# Altium project Soldeerstation.PrjPcb
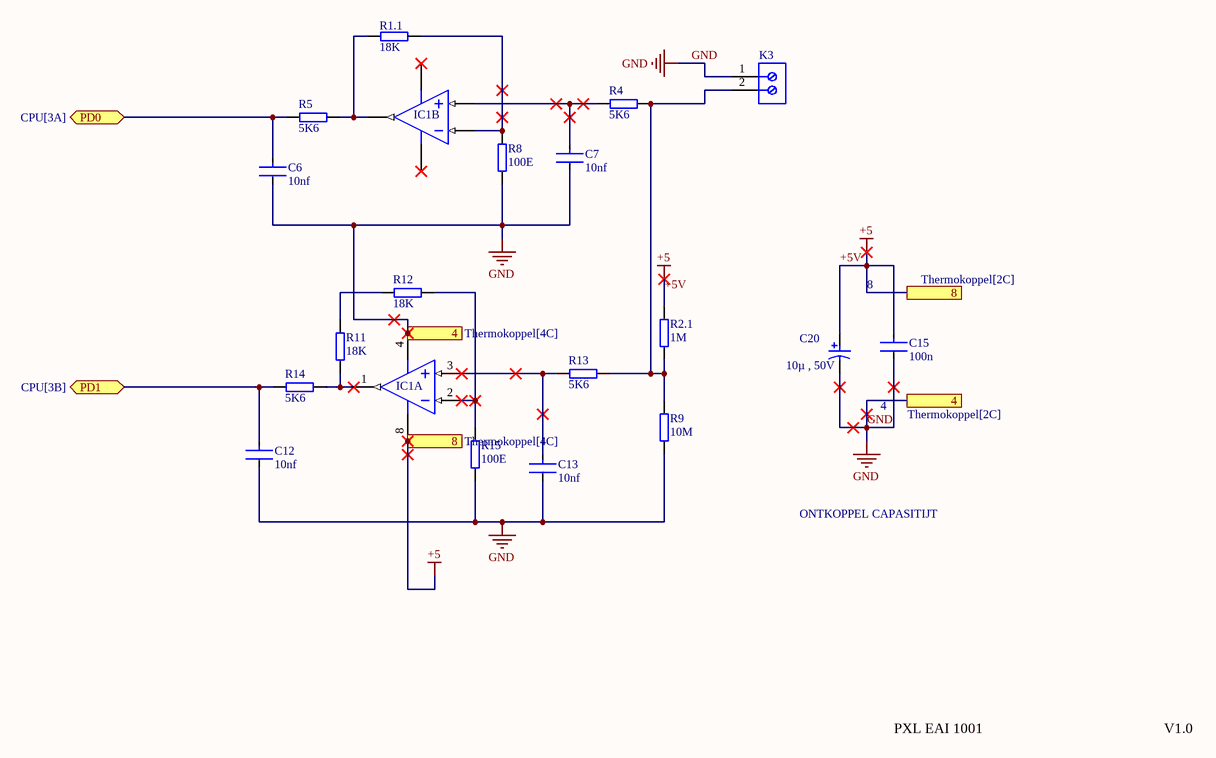
[diagram p0: Thermokoppel.SchDoc]
blad: Soldeerstation; Naam: Ceyhan Yildiz; Sheet: =SheetNumber +' van ' +SheetTotal
5 sheets, 75 parts. Net scope: flat (ports and power ports of the same name join across sheets).
Board files: Soldeer.PcbDoc, Displayd.PcbDoc
Sheets:
  Thermokoppel.SchDoc
  Voeding.SchDoc
  CPU.SchDoc
  PBM_soldeerbout.SchDoc
  Display.SchDoc

## Sheet Thermokoppel.SchDoc
size A4; SheetNumber: 1; SheetTotal: 5

### Parts
C6  10nf  [CC_0805_L]
C7  10nf  [CC_0805_L]
C12  10nf  [CC_0805_L]
C13  10nf  [CC_0805_L]
C15  100n  [CC_0805_L]
C20  10µ , 50V  [CE_D8_L10]
IC1  Dual_Opamp  [MSOP_8_M]  (value not drawn)  (parts A,B of 2)
K3  282836-2  [terminal_block]  (value not drawn)
R1.1  18K  [R_0805_M]
R2.1  1M  [R_0805_M]
R4  5K6  [R_0805_M]
R5  5K6  [R_0805_M]
R8  100E  [R_0805_M]
R9  10M  [R_0805_M]
R11  18K  [R_0805_M]
R12  18K  [R_0805_M]
R13  5K6  [R_0805_M]
R14  5K6  [R_0805_M]
R15  100E  [R_0805_M]

### Ports
4 (see Thermokoppel[2C]), 4 (see Thermokoppel[4C]), 8 (see Thermokoppel[2C]), 8 (see Thermokoppel[4C]), PD0 (bidir, see CPU[3A]), PD1 (bidir, see CPU[3B])

### Nets
+5: C15.1 C20.2 IC1.8(VDD) R2.1.2 ; port 8  [also labelled +5V]
GND: C6.2 C7.2 C12.2 C13.2 C15.2 C20.1 IC1.4(VSS) K3.1 R8.1 R9.1 R15.1 ; port 4
NetC6_1: C6.1 R5.1 ; port PD0
NetC7_1: C7.1 IC1.5(VINB+) R4.1
NetC12_1: C12.1 R14.1 ; port PD1
NetC13_1: C13.1 IC1.3(VINA+) R13.1
NetIC1_1: IC1.1(VOUTA) R11.1 R14.2
NetIC1_2: IC1.2(VINA-) R12.2 R15.2
NetIC1_6: IC1.6(VINB-) R1.1.2 R8.2
NetIC1_7: IC1.7(VOUTB) R1.1.1 R5.2
NetK3_2: K3.2 R2.1.1 R4.2 R9.2 R13.2
NetR11_2: R11.2 R12.1

### Notes on the sheet
- 8
- 4
- ONTKOPPEL CAPASITIJT
- PXL EAI 1001
- V1.0

### Library data of the parts
C6 C7 C12 C13 C15 = Capacitor_Ceramic: Manufacturer: KEMET; Manufacturer Part Number: C0805C224K5RACTU; Value: 0.22 μF; Temperature Characteristic: X7R; Temperature Coefficient: 30ppm/°C; Tolerance: 0.1; Voltage Rating: 50 V; ComponentLink2URL: https://content.kemet.com/datasheets/KEM_C1003_C0G_SMD.pdf; Device Class L3: Ceramic Capacitors; Lead Free: Yes; Temperature: -55°C to +125°C; RoHS: TRUE; Capacitance: 0.22 μF; Automotive: No; Material: Ceramic; Octopart: https://octopart.com/c0805c224k5ractu-kemet-144670; Temperature Range Low: -55°C; Height: 0.88mm; Device Class L1: Passive Components; Digikey Description: CAP CER 0.22UF 50V X7R 0805; ComponentLink2Description: Datasheet; Mouser Description: CAP CER 0.22UF 50V X7R 0805; Category: Cap; Ipc Land Pattern Name: CAPC200125X78; Temperature Range High: +125°C; Package: C0805C-DN; Device Class L2: Capacitors
C20 = Capacitor_Electrolytic: Manufacturer: Panasonic; Voltage Rating: 25 V; ComponentLink2URL: http://industrial.panasonic.com/cdbs/www-data/pdf/RDE0000/ABA0000C1181.pdf; Height: 10.2 mm; Max Operating Temperature: 105 degC; PackageReference: EEE-FK1E221P; ComponentLink1Description: Manufacturer URL; ComponentLink1URL: http://www.panasonic.com/; Mount: Surface Mount; REACH SVHC: No SVHC; Min Operating Temperature: -55 degC; ComponentLink2Description: Datasheet; DatasheetVersion: 03/2016; Length: 10.2 mm; RoHSCompliant: true; Packaging: Tape and Reel; Package Quantity: 500; Lead Pitch: 3.1 mm; Pins: 2; PackageDescription: 2-Pin Electrolytic Aluminum Capacitor, Body 8.3 x 8.3 mm; Mounting Technology: Surface Mount
IC1 = Dual_Opamp: Slew Rate: 0.6V/µs; Supply Current: 100uA; Power Supply Rejection Ratio (PSRR): 86dB; Input Offset Voltage (Vos): 4.5mV; Input Bias Current: 1pA; Amplifier Type: GENERAL PURPOSE; Unity Gain Bandwidth Product: 1MHz; Number of Circuits: 2; Output Current: 23mA; Operating Supply Voltage: 5.5V; Min Supply Voltage: 1.8V; Common Mode Rejection Ratio: 60dB; Voltage Gain: 112dB; Max Supply Voltage: 6V; Package Quantity: 60; REACH SVHC: No SVHC; Min Operating Temperature: -40°C; Max Operating Temperature: 125°C; Mount: Through Hole; Nominal Supply Current: 100uA; Height: 3.3mm; Length: 9.27mm; Slew Rate-Nom: 0.6V/µs; Packaging: Rail/Tube; Output Current per Channel: 23mA; Number of Amplifiers: 2; RoHS Compliant: Yes; Radiation Hardening: No; Bandwidth: 1MHz; Lead Free: Lead Free; Width: 6.35mm; Number of Channels: 2; Gain Bandwidth Product: 1MHz; Technology: CMOS; Operating Supply Current: 100uA; Number of Elements: 2; Number of Pins: 8; Input Offset Voltage-Max: 4.5mV; Case/Package: PDIP
K3 = 1x2 terminal block: Female Header, Pitch 5 mm, 1 x 2 Position, Height 10 mm, Tail Length 3.5 mm, Rohs, Bulk; Manufacturer: TE Connectivity; Wire Gauge: 16-30AWG; Product Training Modules: Wire-to-BoardEurostyleTerminalBlocks; Clamp Material - Plating: Brass-NickelPlated; Voltage: 300V; Mating Orientation: HorizontalwithBoard; Current: 13.5A; Pitch: 0.197"(5.00mm); Screw Thread: M3; 3D Model: 282836-2.pdf; Other Names: 5ULV-02B / A98076; Dynamic Catalog: BuchananSeries; Number of Levels: 1; Torque - Screw: 0.68Nm(6Lb-In); Featured Product: EurostyleTerminalBlockConnectors; Positions Per Level: 2; Wire Termination: Screw-RisingCageClamp; Datasheet URL: http://www.te.com.cn/commerce/DocumentDelivery/DDEController?Action=showdoc&DocId=Catalog+Section%7F1308389_EUROSTYLE_TERMINAL_BLOCKS%7F0607%7Fpdf%7FEnglish%7FENG_CS_1308389_EUROSTYLE_TERMINAL_BLOCKS_0607.pdf%7F282836-2; Color: Green; Family: TerminalBlocks-WiretoBoard; RoHS Information: 282836-2StatementofCompliance; Standard Package: 300; Contact Material - Plating: Brass-TinPlated; Manufacturer URL: http://www.te.com; Housing Material: Polyamide(PA66),Nylon6/6; Features: Interlocking(Side); Package Description: Female Header, Pitch 5 mm, 1 x 2 Position, Height 10 mm, Tail Length 3.5 mm; Mounting Type: ThroughHole; Package Reference: THD; Packaging: Bulk; Series: Buchanan; Category: Connectors,Interconnects; Screw Material - Plating: Brass-NickelPlated
R1.1 R2.1 R4 R5 R8 R9 R11-R15 = Resistor: Manufacturer: Vishay Dale; Part Number: CRCW08050000Z0EA

## Sheet Voeding.SchDoc
size A4; Address1: PXL EAI 1001; Revision: V 1.0; SheetNumber: 2; SheetTotal: 5
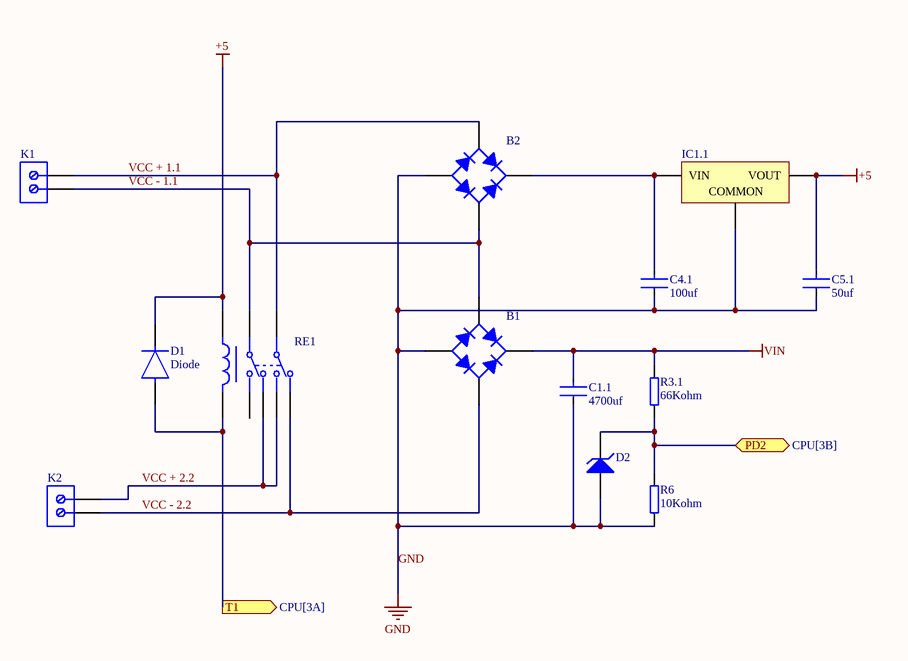
[diagram p1: Voeding.SchDoc]

### Parts
B1  Bridge_Rectifier  [ttf]  (value not drawn)
B2  Bridge_Rectifier  [ttf]  (value not drawn)
C1.1  4700uf  [CE_D25_L25_plugin]
C4.1  100uf  [CC_0805_L]
C5.1  50uf  [CC_0805_L]
D1  Diode  [SOD-123FL]
D2  Zener_Diode  [SOD-123FL]  (value not drawn)
IC1.1  OKI-78SR-5/1.5-W36-C  [OKI78SR515W36C]  (value not drawn)
K1  282836-2  [terminal_block]  (value not drawn)
K2  282836-2  [terminal_block]  (value not drawn)
R3.1  66Kohm  [CC_0805_m]
R6  10Kohm  [CC_0805_m]
RE1  RELAY_GENERAL_PURPOSE  [RT42]  (value not drawn)

### Ports
PD2 (bidir, see CPU[3B]), T1 (out, see CPU[3A])

### Nets
+5: C5.1.1 D1.1(C) IC1.1.3(VOUT) RE1.A1
GND: B1.2(A) B2.2(A) C1.1.2 C4.1.2 C5.1.2 D2.2(A) IC1.1.2(COMMON) R6.2
VIN: B1.1(K) C1.1.1 R3.1.1
VCC + 1.1: B2.3(C) K1.2 RE1.21
VCC + 2.2: K2.2 RE1.12 RE1.24
VCC - 1.1: B1.3(C) B2.4(C) K1.1 RE1.11
VCC - 2.2: B1.4(C) K2.1 RE1.22
NetB2_1: B2.1(K) C4.1.1 IC1.1.1(VIN)
NetD1_2: D1.2(A) RE1.A2 ; port T1
NetD2_1: D2.1(K) R3.1.2 R6.1 ; port PD2

Not connected (* = marked no-connect by the designer): RE1 14

### Library data of the parts
B1 B2 = Bridge_Rectifier: Manufacturer: Diodes Inc; Average Rectified Current-Max: 0.8A; Reverse Voltage-Max [Vrrm]: 600V; Forward Voltage: 1V; Peak Current-Max: 30A; Reverse Current-Max: 5µA; Package Version: 05/2016; Package URL: http://www.diodes.com/_files/packages/MiniDIP.pdf; Datasheet Version: Rev. 13-2, 12/2010; Datasheet URL: http://www.diodes.com/_files/datasheets/ds17003.pdf; Mounting Technology: SurfaceMount; Manufacturer URL: http://www.diodes.com/; Package Reference: MiniDIP-4; Package Description: 4-Pin Small Outline Integrated Circuit, Body 4.7 x 3.8 mm, Pitch 2.5 mm
C1.1 C4.1 C5.1 = Capacitor_Ceramic: as C6 on sheet Thermokoppel; ComponentLink2URL: https://content.kemet.com/datasheets/KEM_C1003_C0G_SMD.pdf; Device Class L3: Ceramic Capacitors; Lead Free: Yes; Temperature: -55°C to +125°C; RoHS: TRUE; Capacitance: 0.22 μF; Automotive: No; Material: Ceramic; Octopart: https://octopart.com/c0805c224k5ractu-kemet-144670; Temperature Range Low: -55°C; Height: 0.88mm; Device Class L1: Passive Components; Digikey Description: CAP CER 0.22UF 50V X7R 0805; ComponentLink2Description: Datasheet; Mouser Description: CAP CER 0.22UF 50V X7R 0805; Category: Cap; Ipc Land Pattern Name: CAPC200125X78; Temperature Range High: +125°C; Package: C0805C-DN; Device Class L2: Capacitors
D1 = Diode: Manufacturer Part Number: 1N4007; Manufacturer: Diotec; Max Surge Forward Current: 27A; Forward Current: 1A; Max Junction Temp: +175°C; Reverse Voltage: 1000V; Value: 15pF; Peak Reverse Current: 5uA; Category: Diode; Temperature Range Low: -50°C; Automotive: No; Temperature: -50°C to +175°C; Lead Free: Yes; ComponentLink2Description: Datasheet; Max Repetitive Reverse Voltage: 1000V; ComponentLink2URL: https://datasheet.octopart.com/1N4007-Diotec-datasheet-62346875.pdf; Device Class L3: Rectifier Diodes; Height: 2.8mm; Octopart: https://octopart.com/1n4007-diotec-4040411; Package: 1N4007; Temperature Range High: +175°C; Device Class L1: Discrete Semiconductors; Device Class L2: Diodes; RoHS: TRUE; Capacitance: 15pF; Ipc Land Pattern Name: DIOAD888W100L520D280
D2 = Zener_Diode: Manufacturer: On Semiconductor; PartNumber: 1SMB5920BT3G; Packing: Tape and Reel; VZ Typ (V): 6.2; PackageDescription: 2-Pin Small Molded Package, J-Bend Lead, Body 4.33 x 3.625 mm; Mounting Technology: Surface Mount; PackageVersion: Rev. H, 05/2011; ComponentLink1Description: Manufacturer URL; RoHS: Pb-Free; DatasheetVersion: Rev. 8; ComponentLink2Description: Datasheet; ComponentLink2URL: http://www.onsemi.com/pub_link/Collateral/1SMB5913BT3-D.PDF; ComponentLink1URL: http://www.onsemi.com/; ComponentLink3Description: Package Specification; PackageReference: SMB-2-403A-03_H; ComponentLink3URL: http://www.onsemi.com/pub_link/Collateral/1SMB5913BT3-D.PDF
IC1.1 = OKI-78SR-5/1.5-W36-C: Non-Isolated DC/DC Converter, 7.5 W, 7 to 36 V, 1.5 A, -40 to 85 degC, 3-Pin THD, RoHS; Manufacturer: Murata; Current - Output (Max): 1.5A; Power (Watts) - Max: 8W; Efficiency: 90.5%; Voltage - Input (Min): 7V; Voltage - Input (Max): 36V; Voltage - Output 1: 5V; Number of Outputs: 1; Package / Case: 3-SIPModule; Features: SCP; Type: LinearRegulatorReplacement; Size / Dimension: 0.41"Lx0.30"Wx0.65"H(10.4mmx7.6mmx16.5mm); Datasheet URL: https://datasheet.ciiva.com/8006/1790439-8006672.pdf; Datasheet Version: Oct-13; Power (Watts) - Manufacture Series: 8W; Voltage - Output 2: -; Series: Okami™OKI-78SR; Family: DCDCConverters; Manufacturer URL: http://www.murata.com/; Category: PowerSupplies-BoardMount; Voltage - Isolation: -; Packaging: Tube; Applications: ITE(Commercial); Mounting Type: ThroughHole; Voltage - Output 3: -; Operating Temperature: -40degC~85degC
K1 K2 = 1x2 terminal block: as K3 on sheet Thermokoppel; Datasheet URL: http://www.te.com.cn/commerce/DocumentDelivery/DDEController?Action=showdoc&DocId=Catalog+Section%7F1308389_EUROSTYLE_TERMINAL_BLOCKS%7F0607%7Fpdf%7FEnglish%7FENG_CS_1308389_EUROSTYLE_TERMINAL_BLOCKS_0607.pdf%7F282836-2; Color: Green; Family: TerminalBlocks-WiretoBoard; RoHS Information: 282836-2StatementofCompliance; Standard Package: 300; Contact Material - Plating: Brass-TinPlated; Manufacturer URL: http://www.te.com; Housing Material: Polyamide(PA66),Nylon6/6; Features: Interlocking(Side); Package Description: Female Header, Pitch 5 mm, 1 x 2 Position, Height 10 mm, Tail Length 3.5 mm; Mounting Type: ThroughHole; Package Reference: THD; Packaging: Bulk; Series: Buchanan; Category: Connectors,Interconnects; Screw Material - Plating: Brass-NickelPlated
R3.1 R6 = Resistor: as R1.1 on sheet Thermokoppel
RE1 = RELAY_GENERAL_PURPOSE: Manufacturer Part Number: RT424005; Manufacturer: TE Connectivity; Coil Power: 403mW; Throw Configuration: DPDT; Coil Voltage: 5V; Number Of Contacts: 2; Coil Resistance: 62Ω; Current Rating: 8A; Coil Type: Non-Latching; Category: Relay; Octopart: https://octopart.com/5-1393243-9-te+connectivity-41835766; Device Class L3: Power Relays; ComponentLink2URL: https://www.te.com/commerce/DocumentDelivery/DDEController?Action=showdoc&DocId=Data+Sheet%7FRT2%7F1014%7Fpdf%7FEnglish%7FENG_DS_RT2_1014.pdf%7F5-1393243-9; Ambient Temperature Range High: +85°C; ComponentLink2Description: Datasheet; Digikey Description: RELAY GENERAL PURPOSE DPDT 8A 5V; Package: RT424005; Automotive: No; Device Class L1: Electromechanical; Height: 15.7mm; Device Class L2: Relays; Ambient Temperature Range Low: -40°C; Mouser Description: General Purpose Relay, Rt2 Series, Power, Non Latching, Dpdt, 5 Vdc, 8 A Rohs Compliant: Yes; Lead Free: Yes; RoHS: TRUE

## Sheet CPU.SchDoc
size A4; Address1: PXL EAI 1001; Revision: V 1.0; SheetNumber: 3; SheetTotal: 5; Sheet: 3 van 5
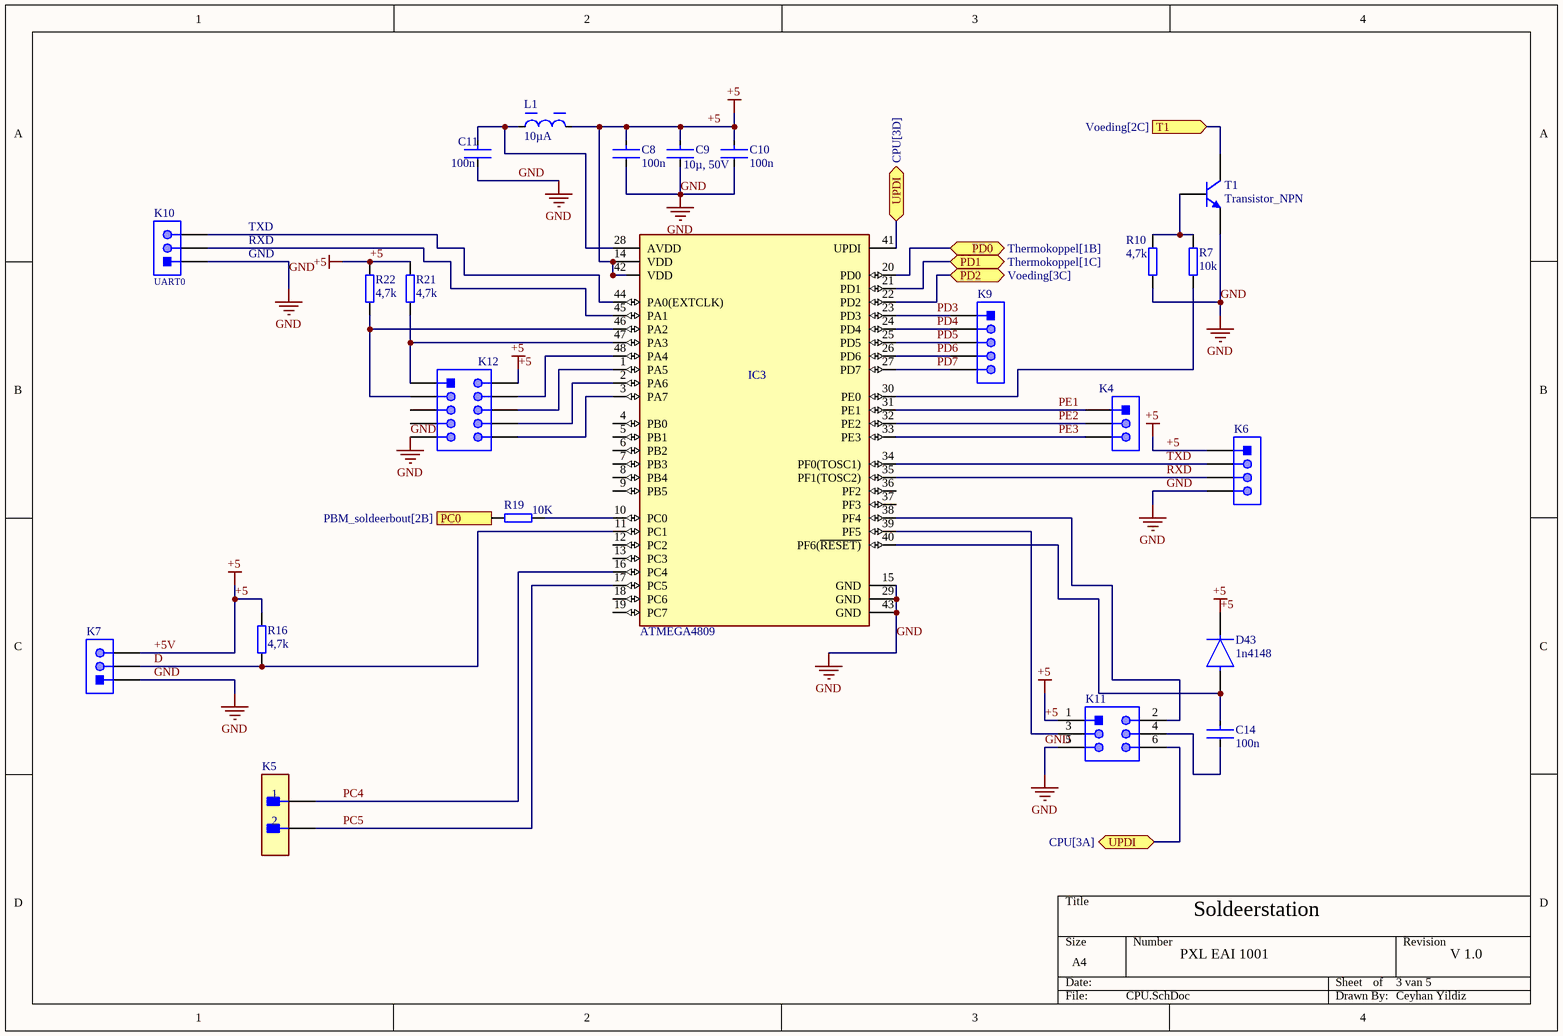
[diagram p2: CPU.SchDoc]

### Parts
C8  100n  [CC_0805_L]
C9  10µ, 50V  [CC_0805_L]
C10  100n  [CC_0805_L]
C11  100n  [CC_0805_L]
C14  100n  [CC_0805_L]
D43  1n4148  [SOD-123FL]
IC3  ATMEGA4809  [TQFP_48_M]
K4  61300311121  [pin header 1x3 - duplicate]  (value not drawn)
K5  M20-9990246  [pin header 1x2 - duplicate]  (value not drawn)
K6  61300411121  [pin header 1x4 - duplicate]  (value not drawn)
K7  61300311121  [pin header 1x3 - duplicate]  (value not drawn)
K9  61300511121  [pin header 1x5]  (value not drawn)
K10  UART0  [pin header 1x3 - duplicate]
K11  61300621121  [pin header 2x6]  (value not drawn)
K12  61201021621  [box header 10-pin]  (value not drawn)
L1  10µA  [CC_0805_L]
R7  10k  [R_0805_M]
R10  4,7k  [R_0805_M]
R16  4,7k  [R_0805_M]
R19  10K  [R_0805_M]
R21  4,7k  [R_0805_M]
R22  4,7k  [R_0805_M]
T1  Transistor_NPN  [SOT_23]

### Ports
PC0 (see PBM_soldeerbout[2B]), PD0 (bidir, see Thermokoppel[1B]), PD1 (bidir, see Thermokoppel[1C]), PD2 (bidir, see Voeding[3C]), T1 (in, see Voeding[2C]), UPDI (bidir, see CPU[3A]), UPDI (bidir, see CPU[3D])

### Nets
+5: C8.1 C9.1 C10.1 D43.1(C) IC3.14(VDD) IC3.42(VDD) K6.1 K7.3 K11.1 K12.2 L1.2 R16.2 R21.2 R22.2  [also labelled +5V]
GND: C8.2 C9.2 C10.2 C11.2 IC3.15(GND) IC3.29(GND) IC3.43(GND) K6.4 K7.1 K10.1 K11.5 K12.9 R10.1 T1.3(E)
D: IC3.11(PC1) K7.2 R16.1
PC4: IC3.16(PC4) K5.1
PC5: IC3.17(PC5) K5.2
PD3: IC3.23(PD3) K9.1
PD4: IC3.24(PD4) K9.2
PD5: IC3.25(PD5) K9.3
PD6: IC3.26(PD6) K9.4
PD7: IC3.27(PD7) K9.5
PE1: IC3.31(PE1) K4.1
PE2: IC3.32(PE2) K4.2
PE3: IC3.33(PE3) K4.3
RXD: IC3.35(PF1(TOSC2)) K6.3
TXD: IC3.34(PF0(TOSC1)) K6.2
NetC6_1: IC3.20(PD0) ; port PD0
NetC11_1: C11.1 IC3.28(AVDD) L1.1
NetC12_1: IC3.21(PD1) ; port PD1
NetC14_1: C14.1 D43.2(A) IC3.40(PF6(~{RESET)})
NetC14_2: C14.2 K11.4
NetD1_2: T1.1(C) ; port T1
NetD2_1: IC3.22(PD2) ; port PD2
NetIC3_1: IC3.1(PA5) K12.6
NetIC3_2: IC3.2(PA6) K12.8
NetIC3_3: IC3.3(PA7) K12.10
NetIC3_10: IC3.10(PC0) R19.2
NetIC3_30: IC3.30(PE0) R7.1
NetIC3_38: IC3.38(PF4) K11.2
NetIC3_39: IC3.39(PF5) K11.3
NetIC3_41: IC3.41(UPDI) K11.6 ; port UPDI
NetIC3_44: IC3.44(PA0(EXTCLK)) K10.3
NetIC3_45: IC3.45(PA1) K10.2
NetIC3_46: IC3.46(PA2) K12.3 R22.1
NetIC3_47: IC3.47(PA3) K12.1 R21.1
NetIC3_48: IC3.48(PA4) K12.4
NetR7_2: R7.2 R10.2 T1.2(B)
NetR19_1: R19.1 ; port PC0

Not connected (* = marked no-connect by the designer): IC3 4(PB0) 5(PB1) 6(PB2) 7(PB3) 8(PB4) 9(PB5) 12(PC2) 13(PC3) 18(PC6) 19(PC7) 36(PF2) 37(PF3); K12 5 7

### Notes on the sheet
- TXD
- RXD
- GND

### Library data of the parts
C8 C10 C11 C14 = Capacitor_Ceramic: as C6 on sheet Thermokoppel; ComponentLink2URL: https://content.kemet.com/datasheets/KEM_C1003_C0G_SMD.pdf; Device Class L3: Ceramic Capacitors; Lead Free: Yes; Temperature: -55°C to +125°C; RoHS: TRUE; Capacitance: 0.22 μF; Automotive: No; Material: Ceramic; Octopart: https://octopart.com/c0805c224k5ractu-kemet-144670; Temperature Range Low: -55°C; Height: 0.88mm; Device Class L1: Passive Components; Digikey Description: CAP CER 0.22UF 50V X7R 0805; ComponentLink2Description: Datasheet; Mouser Description: CAP CER 0.22UF 50V X7R 0805; Category: Cap; Ipc Land Pattern Name: CAPC200125X78; Temperature Range High: +125°C; Package: C0805C-DN; Device Class L2: Capacitors
C9 = Capacitor_Ceramic: Manufacturer: KEMET; Manufacturer Part Number: C0805C224K5RACTU; Value: 0.22 μF; Temperature Characteristic: X7R; Temperature Coefficient: 30ppm/°C; Tolerance: 0.1; ComponentLink2URL: https://content.kemet.com/datasheets/KEM_C1003_C0G_SMD.pdf; Device Class L3: Ceramic Capacitors; Lead Free: Yes; Temperature: -55°C to +125°C; RoHS: TRUE; Capacitance: 0.22 μF; Automotive: No; Material: Ceramic; Octopart: https://octopart.com/c0805c224k5ractu-kemet-144670; Temperature Range Low: -55°C; Height: 0.88mm; Device Class L1: Passive Components; Digikey Description: CAP CER 0.22UF 50V X7R 0805; ComponentLink2Description: Datasheet; Mouser Description: CAP CER 0.22UF 50V X7R 0805; Category: Cap; Ipc Land Pattern Name: CAPC200125X78; Temperature Range High: +125°C; Package: C0805C-DN; Device Class L2: Capacitors; Voltage Rating: 50 V
D43 = Diode: as D1 on sheet Voeding; Category: Diode; Temperature Range Low: -50°C; Automotive: No; Temperature: -50°C to +175°C; Lead Free: Yes; ComponentLink2Description: Datasheet; Max Repetitive Reverse Voltage: 1000V; ComponentLink2URL: https://datasheet.octopart.com/1N4007-Diotec-datasheet-62346875.pdf; Device Class L3: Rectifier Diodes; Height: 2.8mm; Octopart: https://octopart.com/1n4007-diotec-4040411; Package: 1N4007; Temperature Range High: +175°C; Device Class L1: Discrete Semiconductors; Device Class L2: Diodes; RoHS: TRUE; Capacitance: 15pF; Ipc Land Pattern Name: DIOAD888W100L520D280
IC3 = ATMEGA4809: Peripherals: Brown-out Detect/Reset; Number of I/Os: 41; Core Architecture: AVR; Memory Size: 48KB; Interface: I2C; Oscillator Type: Internal; Memory Type: FLASH; Series: megaAVR® 0, Functional Safety (FuSa); Min Operating Temperature: -40°C; Mount: Surface Mount; Case/Package: TQFP; RoHS Compliant: Yes; Max Operating Temperature: 85°C
K4 K7 = 1x3: THT Vertical Pin Header WR-PHD, Pitch 2.54 mm, Single Row, 3 pins; Manufacturer: Wurth Elektronik; Withstanding Voltage: 500VAC; Working Voltage: 250VAC; Rated Current: 3A; Pitch: 2.54mm; Pin Number: 3; Gender: Male; Contact Resistance: 20mOhm; Package Reference: 61300311121; Manufacturer URL: http://www.we-online.de; Datasheet URL: https://katalog.we-online.de/em/datasheet/6130xx11121.pdf; Operating Temperature: -40to105degC; Part Number: 61300311121; Orientation: Vertical; Packaging: Bag; Row Number: Single; Mounting Technology: THT; Publisher: WurthElektronik
K5 = 1x2: CONN HEADER VERT 2POS 2.54MM; Manufacturer: Harwin; Conn Gender: Male; Conn Orientation: Vertical; Number Of Contacts: 2; Current Rating: 3A; ComponentLink2URL: https://cdn.harwin.com/pdfs/M20-999.pdf; ComponentLink2Description: Datasheet; Package: M20-9990246; Temperature: -40°C to +105°C; Octopart: https://octopart.com/m20-9990246-harwin-2590635; Mouser Description: 2.54mm (0.1") Pitch SIL Vertical PC Tail Pin Header, 6.1mm mating pin height, tin, 2 contacts; Temperature Range High: +105°C; Device Class L1: Connectors; RoHS: TRUE; Automotive: No; Height: 8.99mm; Number Of Rows: 1; Contact Material: Tin,Nickel; Category: Conn; Pitch: 2.54mm; Lead Free: Yes; Digikey Description: CONN HEADER VERT 2POS 2.54MM; Manufacturer Part Number: M20-9990246; Temperature Range Low: -40°C; Device Class L3: unset; Device Class L2: Headers and Wire Housings
K6 = 1x4: THT Vertical Pin Header WR-PHD, Pitch 2.54 mm, Single Row, 4 pins; Manufacturer: Wurth Elektronik; Withstanding Voltage: 500VAC; Rated Current: 3A; Working Voltage: 250VAC; Pin Number: 4; Gender: Male; Contact Resistance: 20mOhm; Pitch: 2.54mm; Manufacturer URL: http://www.we-online.de; Operating Temperature: -40to105degC; Packaging: Bag; Mounting Technology: THT; Package Reference: 61300411121; Datasheet URL: https://katalog.we-online.de/em/datasheet/6130xx11121.pdf; Publisher: WurthElektronik; Part Number: 61300411121; Row Number: Single; Orientation: Vertical
K9 = 1x5: THT Vertical Pin Header WR-PHD, Pitch 2.54 mm, Single Row, 5 pins; Manufacturer: Wurth Elektronik; Pin Number: 5; Contact Resistance: 20mOhm; Working Voltage: 250VAC; Pitch: 2.54mm; Withstanding Voltage: 500VAC; Rated Current: 3A; Gender: Male; Datasheet URL: https://katalog.we-online.de/em/datasheet/6130xx11121.pdf; Orientation: Vertical; Mounting Technology: THT; Row Number: Single; Package Reference: 61300511121; Publisher: WurthElektronik; Part Number: 61300511121; Packaging: Bag; Manufacturer URL: http://www.we-online.de; Operating Temperature: -40to105degC
K10 = 1x3: THT Vertical Pin Header WR-PHD, Pitch 2.54 mm, Single Row, 3 pins; Part Number: 61300311121; Manufacturer: Wurth Elektronik; Withstanding Voltage: 500VAC; Working Voltage: 250VAC; Rated Current: 3A; Pitch: 2.54mm; Pin Number: 3; Gender: Male; Contact Resistance: 20mOhm; Package Reference: 61300311121; Manufacturer URL: http://www.we-online.de; Datasheet URL: https://katalog.we-online.de/em/datasheet/6130xx11121.pdf; Operating Temperature: -40to105degC; Orientation: Vertical; Packaging: Bag; Row Number: Single; Mounting Technology: THT; Publisher: WurthElektronik
K11 = 2x3: THT Vertical Pin Header WR-PHD, Pitch 2.54 mm, Dual Row, 6 pins; Manufacturer: Wurth Elektronik; Contact Resistance: 20mOhm; Withstanding Voltage: 500VAC; Pin Number: 6; Gender: Male; Pitch: 2.54mm; Working Voltage: 250VAC; Rated Current: 3A; Packaging: Bag; Row Number: Dual; Manufacturer URL: http://www.we-online.de; Part Number: 61300621121; Operating Temperature: -40to105degC; Mounting Technology: THT; Package Reference: 61300621121; Datasheet URL: https://katalog.we-online.de/em/datasheet/6130xx21121.pdf; Orientation: Vertical; Publisher: WurthElektronik
K12 = 5x2: Male Box Header WR-BHD, THT, Vertical, pitch 2.54 mm, 10 pins; Manufacturer: Wurth Elektronik; Contact Resistance: 20mOhm; Withstanding Voltage: 500VAC; Pin Number: 10; Working Voltage: 250VAC; Pitch: 2.54mm; Mounting Technology: THT; Operating Temperature: -40to125degC; Published Date: August2018; Gender: Male; Packaging: Tray; Manufacturer URL: http://www.we-online.de; Datasheet URL: https://katalog.we-online.de/em/datasheet/6120xx21621.pdf; Orientation: Vertical; Package Reference: 61201021621; Part Number: 61201021621; Publisher: WurthElektronik
L1 = Choke: Tolerance: 20%; Shielding: Shielded; Saturation Current: 10A; Test Frequency: 100kHz; RMS Current (Irms): 8.5A; Inductance: 10uH; Series Resistance: 14.1R; DC Resistance (DCR): 14.1mR; Self Resonant Frequency: 18MHz; Ratings: AEC-Q200; Width: 12.8mm; Series: WE-HCI; Length: 0.512inch; Mount: Surface Mount; Resistor Type: Wirewound; RoHS Compliant: Yes; Package Quantity: 1; Min Operating Temperature: -40°C; Inductance Tolerance: 20%; Termination: SMD/SMT; Max DC Current: 8.5A; Height - Seated (Max): 0.197inch; Case/Package: 1350; Current Rating: 8.5A; Max Operating Temperature: 155°C; Packaging: Tape and Reel; Height: 4.7mm
R7 R10 R16 R19 R21 R22 = Resistor: as R1.1 on sheet Thermokoppel
T1 = Transistor_NPN: Manufacturer: On Semiconductor; PartNumber: BC547C; IC Continuous (A): 0.1; fT Min (MHz): 150; Packing: Bulk Box; Polarity: NPN; Mounting Technology: Through Hole; ComponentLink1URL: http://www.onsemi.com/; ComponentLink1Description: Manufacturer URL; ComponentLink3URL: http://www.onsemi.cn/pub_link/Collateral/2N6426-D.PDF; DatasheetVersion: Rev. 7; PackageVersion: Rev. AM; RoHS: FALSE; ComponentLink2URL: http://www.onsemi.com/pub_link/Collateral/BC546-D.PDF; ComponentLink3Description: Package Specification; PackageDescription: 3-Pin Transistor Outline, Body 4.825 x 3.685 mm, Pitch 1.27 mm; PackageReference: TO-92-3-29-11_AM_SL; ComponentLink2Description: Datasheet

## Sheet PBM_soldeerbout.SchDoc
size A4; Address1: PXL EAI 1001; Revision: V 1.0; SheetNumber: 4; SheetTotal: 5
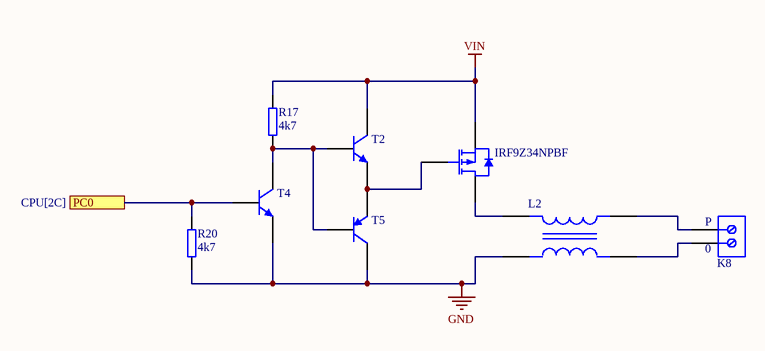
[diagram p3: PBM_soldeerbout.SchDoc]

### Parts
IRF9Z34NPBF  MOSFET_P  [TO_252]  (value not drawn)
K8  282836-2  [terminal_block]  (value not drawn)
L2  Common_Mode_Choke  [2545]  (value not drawn)
R17  4k7  [CC_0805_m]
R20  4k7  [R_0805_L]
T2  BC547  [SOT_23]  (value not drawn)
T4  BC547  [SOT_23]  (value not drawn)
T5  BC557  [SOT_23]  (value not drawn)

### Ports
PC0 (see CPU[2C])

### Nets
GND: L2.2 R20.1 T4.3(E) T5.1(C)
VIN: IRF9Z34NPBF.2(SOURCE) R17.2 T2.1(C)
NetIRF9Z34NPBF_1: IRF9Z34NPBF.1(GATE) T2.3(E) T5.3(E)
NetIRF9Z34NPBF_3: IRF9Z34NPBF.3(DRAIN) L2.1
NetK8_1: K8.1 L2.4
NetK8_2: K8.2 L2.3
NetR17_1: R17.1 T2.2(B) T4.1(C) T5.2(B)
NetR19_1: R20.2 T4.2(B) ; port PC0

### Notes on the sheet
- (near K8) P
- (near K8) 0

### Library data of the parts
IRF9Z34NPBF = MOSFET_P: Manufacturer: Fairchild Semiconductor; Reel Quantity: 3000; Drain Source Voltage Vds: 20V; Power Dissipation Pd: 500mW; On Resistance Rds(on): 52mohm; Full Power Rating Temperature: 25°C; Voltage Vgs Max: -800mV; Pulse Current Idm: 10A; Rds(on) Test Voltage Vgs: -4.5V; External Depth: 2.5mm; Transistor Case Style: SOT-23; No. of Pins: 3; Continuous Drain Current Id: 2.4A; Voltage Vds Typ: -20V; Voltage Vgs th Max: -1.5V; Transistor Polarity: PChannel; Package Version: Rev. 3, 05/2015; External Width: 3.05mm; External Length / Height: 1.12mm; SMD Marking: 304P; SVHC: NoSVHC(19-Dec-2012); Termination Type: SMD; Datasheet URL: https://www.fairchildsemi.com/datasheets/FD/FDN304P.pdf; Tape Width: 8mm; Mounting Technology: SurfaceMount; Voltage Vgs Rds on Measurement: -4.5V; Operating Temperature Range: -55°Cto+150°C; Current Temperature: 25°C; Operating Temperature Min: -55°C; Threshold Voltage Vgs Typ: -800mV; Package / Case: SOT-23; Manufacturer URL: https://www.fairchildsemi.com/; Voltage Vds: 20V; Datasheet Version: Rev. C, 01/2001; Operating Temperature Max: 150°C; Package Description: 3-Pin Small Outline Transistor, Body 2.92 x 1.4 mm, Pitch 0.95 mm; Current Id Max: 2.4A; Package URL: https://www.fairchildsemi.com/package-drawings/MA/MA03B.pdf; Package Reference: SSOT3L
K8 = 1x2 terminal block: as K3 on sheet Thermokoppel; Datasheet URL: http://www.te.com.cn/commerce/DocumentDelivery/DDEController?Action=showdoc&DocId=Catalog+Section%7F1308389_EUROSTYLE_TERMINAL_BLOCKS%7F0607%7Fpdf%7FEnglish%7FENG_CS_1308389_EUROSTYLE_TERMINAL_BLOCKS_0607.pdf%7F282836-2; Color: Green; Family: TerminalBlocks-WiretoBoard; RoHS Information: 282836-2StatementofCompliance; Standard Package: 300; Contact Material - Plating: Brass-TinPlated; Manufacturer URL: http://www.te.com; Housing Material: Polyamide(PA66),Nylon6/6; Features: Interlocking(Side); Package Description: Female Header, Pitch 5 mm, 1 x 2 Position, Height 10 mm, Tail Length 3.5 mm; Mounting Type: ThroughHole; Package Reference: THD; Packaging: Bulk; Series: Buchanan; Category: Connectors,Interconnects; Screw Material - Plating: Brass-NickelPlated
L2 = Common_Mode_Choke: Max Current Rating: 2A; Number of Lines: 2; Impedance: 900R; Element Configuration: Dual; Insulation Resistance: 10MR; Test Frequency: 100MHz; DC Resistance (DCR): 60mR; Voltage Rating (DC): 50V; Current Rating: 2.3A; Number of Pins: 4; DC Current: 2A; Mount: Surface Mount; Current: 2A; REACH SVHC: No SVHC; Width: 4.5mm; Case/Package: 1808; Voltage Rating: 50V; Package Quantity: 1; Height: 2mm; Max DC Current: 2A; Packaging: Tape and Reel; Max Operating Temperature: 85°C; Lead Free: Lead Free; Length: 0.185inch; Series: ACM; Radiation Hardening: No; Max Voltage Rating (DC): 50V; Termination: Flat; Depth: 4.7mm; RoHS Compliant: Yes; DC Resistance-Max: 60mR; Min Operating Temperature: -40°C
R17 R20 = Resistor: as R1.1 on sheet Thermokoppel
T2 T4 = Transistor_NPN: as T1 on sheet CPU; Mounting Technology: Through Hole; ComponentLink1URL: http://www.onsemi.com/; ComponentLink1Description: Manufacturer URL; ComponentLink3URL: http://www.onsemi.cn/pub_link/Collateral/2N6426-D.PDF; DatasheetVersion: Rev. 7; PackageVersion: Rev. AM; RoHS: FALSE; ComponentLink2URL: http://www.onsemi.com/pub_link/Collateral/BC546-D.PDF; ComponentLink3Description: Package Specification; PackageDescription: 3-Pin Transistor Outline, Body 4.825 x 3.685 mm, Pitch 1.27 mm; PackageReference: TO-92-3-29-11_AM_SL; ComponentLink2Description: Datasheet
T5 = Transistor_PNP: Manufacturer: On Semiconductor; PartNumber: BC557C; Polarity: PNP; IC Continuous (A): -0.1; Packing: Bulk Box; PackageVersion: Rev. AM; RoHS: FALSE; PackageDescription: 3-Pin Transistor Outline, Body 4.825 x 3.685 mm, Pitch 1.27 mm; ComponentLink2Description: Datasheet; DatasheetVersion: Rev. 3; ComponentLink3Description: Package Specification; Mounting Technology: Through Hole; ComponentLink2URL: http://www.onsemi.com/pub_link/Collateral/BC556B-D.PDF; ComponentLink1URL: http://www.onsemi.com/; ComponentLink1Description: Manufacturer URL; ComponentLink3URL: http://www.onsemi.cn/pub_link/Collateral/2N6426-D.PDF; PackageReference: TO-92-3-29-11_AM_SL

## Sheet Display.SchDoc
size A4; SheetNumber: 5; SheetTotal: 5
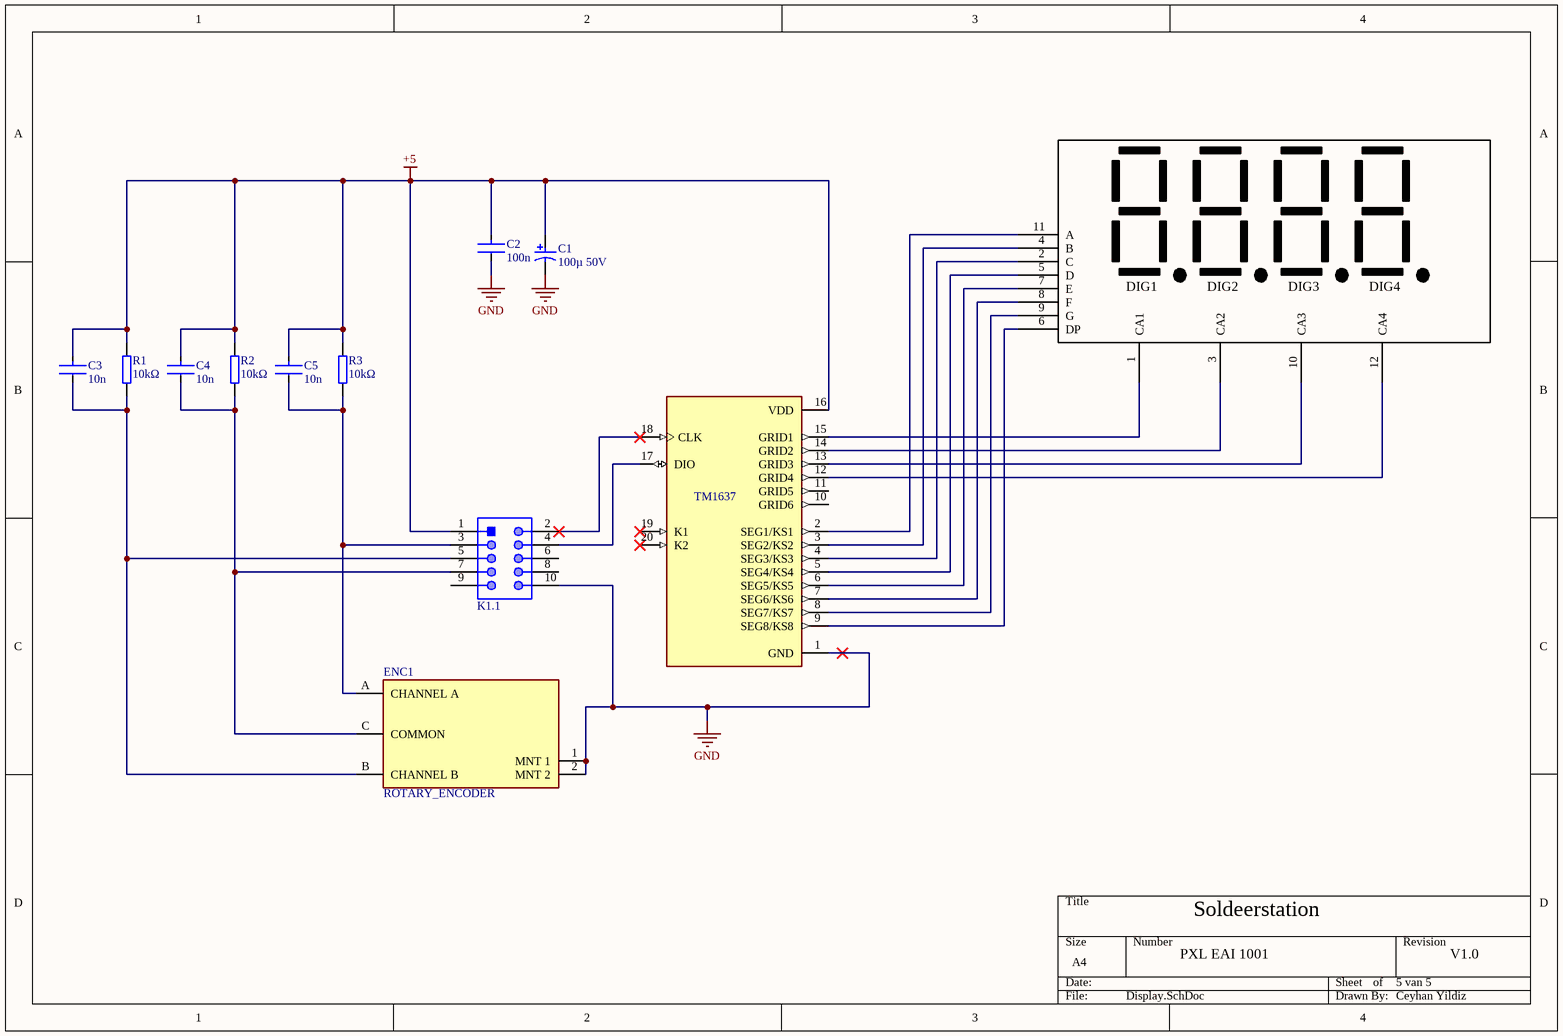
[diagram p4: Display.SchDoc]

### Parts
C1  100µ 50V  [CC_0805_L]
C2  100n  [CC_0805_L]
C3  10n  [CC_0805_L]
C4  10n  [CC_0805_L]
C5  10n  [CC_0805_L]
Display  Sigment  [7-Sigment]  (value not drawn)
ENC1  ROTARY_ENCODER  [PEC11R_4220F_S0012]
K1.1  61201021621  [box header 10-pin]  (value not drawn)
R1  10kΩ  [R_0805_M]
R2  10kΩ  [R_0805_M]
R3  10kΩ  [R_0805_M]
TM1637  TM1637  [SOP_20_M]

### Nets
+5: C1.2 C2.1 C3.1 C4.1 C5.1 K1.1.1 R1.2 R2.2 R3.2 TM1637.16(VDD)
GND: C1.1 C2.2 ENC1.1(MNT_1) ENC1.2(MNT_2) K1.1.10 TM1637.1(GND)
NetC3_2: C3.2 ENC1.B(CHANNEL_B) K1.1.5 R1.1
NetC4_2: C4.2 ENC1.C(COMMON) K1.1.7 R2.1
NetC5_2: C5.2 ENC1.A(CHANNEL_A) K1.1.3 R3.1
NetDisplay_1: Display.1(CA1) TM1637.15(GRID1)
NetDisplay_2: Display.2(C) TM1637.4(SEG3/KS3)
NetDisplay_3: Display.3(CA2) TM1637.14(GRID2)
NetDisplay_4: Display.4(B) TM1637.3(SEG2/KS2)
NetDisplay_5: Display.5(D) TM1637.5(SEG4/KS4)
NetDisplay_6: Display.6(DP) TM1637.9(SEG8/KS8)
NetDisplay_7: Display.7(E) TM1637.6(SEG5/KS5)
NetDisplay_8: Display.8(F) TM1637.7(SEG6/KS6)
NetDisplay_9: Display.9(G) TM1637.8(SEG7/KS7)
NetDisplay_10: Display.10(CA3) TM1637.13(GRID3)
NetDisplay_11: Display.11(A) TM1637.2(SEG1/KS1)
NetDisplay_12: Display.12(CA4) TM1637.12(GRID4)
NetK1.1_2: K1.1.2 TM1637.18(CLK)
NetK1.1_4: K1.1.4 TM1637.17(DIO)

Not connected (* = marked no-connect by the designer): K1.1 6 8 9; TM1637 10(GRID6) 11(GRID5) 19(K1)* 20(K2)*

### Notes on the sheet
- PXL EAI 1001
- V1.0
- (in symbol Display 4digit 7segment) DIG1; DIG2; DIG3; DIG4

### Library data of the parts
C1 = Capacitor_Electrolytic: as C20 on sheet Thermokoppel; ComponentLink2URL: http://industrial.panasonic.com/cdbs/www-data/pdf/RDE0000/ABA0000C1181.pdf; Height: 10.2 mm; Max Operating Temperature: 105 degC; PackageReference: EEE-FK1E221P; ComponentLink1Description: Manufacturer URL; ComponentLink1URL: http://www.panasonic.com/; Mount: Surface Mount; REACH SVHC: No SVHC; Min Operating Temperature: -55 degC; ComponentLink2Description: Datasheet; DatasheetVersion: 03/2016; Length: 10.2 mm; RoHSCompliant: true; Packaging: Tape and Reel; Package Quantity: 500; Lead Pitch: 3.1 mm; Pins: 2; PackageDescription: 2-Pin Electrolytic Aluminum Capacitor, Body 8.3 x 8.3 mm; Mounting Technology: Surface Mount
C2-C5 = Capacitor_Ceramic: as C6 on sheet Thermokoppel; ComponentLink2URL: https://content.kemet.com/datasheets/KEM_C1003_C0G_SMD.pdf; Device Class L3: Ceramic Capacitors; Lead Free: Yes; Temperature: -55°C to +125°C; RoHS: TRUE; Capacitance: 0.22 μF; Automotive: No; Material: Ceramic; Octopart: https://octopart.com/c0805c224k5ractu-kemet-144670; Temperature Range Low: -55°C; Height: 0.88mm; Device Class L1: Passive Components; Digikey Description: CAP CER 0.22UF 50V X7R 0805; ComponentLink2Description: Datasheet; Mouser Description: CAP CER 0.22UF 50V X7R 0805; Category: Cap; Ipc Land Pattern Name: CAPC200125X78; Temperature Range High: +125°C; Package: C0805C-DN; Device Class L2: Capacitors
Display = Display 4digit 7segment
ENC1 = ROTARY_ENCODER: Manufacturer Part Number: PEC11R-4015F-N0024; Manufacturer: Bourns; Current Rating: 10mA; Number Of Circuits: 1; Conn Orientation: Vertical; Encoder Type: Incremental; Detent: No; Pulses Per Rev: 24; Voltage Rating Dc: 5V; Height: 22.3mm; ComponentLink2URL: https://www.bourns.com/docs/product-datasheets/pec11r.pdf?sfvrsn=bb617cbf_7; Mouser Description: Encoders 15mm SHAFT NO SWITCH; Package: 0; RoHS: TRUE; Temperature Range High: +70°C; Device Class L1: Electromechanical; Device Class L3: Encoders; Temperature Range Low: -30°C; Device Class L2: Switches; Temperature: -30°C to +70°C; Category: Enc; ComponentLink2Description: Datasheet; Lead Free: Yes; Automotive: No; Octopart: https://octopart.com/pec11r-4015f-n0024-bourns-26648251; Digikey Description: ROTARY ENCODER MECHANICAL 24PPR
K1.1 = 5x2: as K12 on sheet CPU; Mounting Technology: THT; Operating Temperature: -40to125degC; Published Date: August2018; Gender: Male; Packaging: Tray; Manufacturer URL: http://www.we-online.de; Datasheet URL: https://katalog.we-online.de/em/datasheet/6120xx21621.pdf; Orientation: Vertical; Package Reference: 61201021621; Part Number: 61201021621; Publisher: WurthElektronik
R1-R3 = Resistor: as R1.1 on sheet Thermokoppel
TM1637 = TM1637: LED Drive Control Special Circuit; MF: Titan Micro Electronics; Package: Package; Availability: Not in stock; SnapEDA_Link: https://www.snapeda.com/parts/TM1637/Titan+Micro+Electronics/view-part/?ref=snap; MP: TM1637; Check_prices: https://www.snapeda.com/parts/TM1637/Titan+Micro+Electronics/view-part/?ref=eda; Value: *; Price: None

## Nets that join several sheets
+5: Thermokoppel (C15.1 C20.2 IC1.8 R2.1.2), Voeding (C5.1.1 D1.1 IC1.1.3 RE1.A1), CPU (14 pins), Display (10 pins)
GND: Thermokoppel (11 pins), Voeding (8 pins), CPU (14 pins), PBM_soldeerbout (L2.2 R20.1 T4.3 T5.1), Display (6 pins)
VIN: Voeding (B1.1 C1.1.1 R3.1.1), PBM_soldeerbout (IRF9Z34NPBF.2 R17.2 T2.1)
NetC6_1: Thermokoppel (C6.1 R5.1), CPU (IC3.20)
NetC12_1: Thermokoppel (C12.1 R14.1), CPU (IC3.21)
NetD1_2: Voeding (D1.2 RE1.A2), CPU (T1.1)
NetD2_1: Voeding (D2.1 R3.1.2 R6.1), CPU (IC3.22)
NetR19_1: CPU (R19.1), PBM_soldeerbout (R20.2 T4.2)